# EasyEDA schematic Polarization Contol.json

## Sheets
1 Sheet_1: TITLE: Sheet_1; REV: 1.0; Date: 2023-02-22; Sheet: 1/1; Company: Your Company
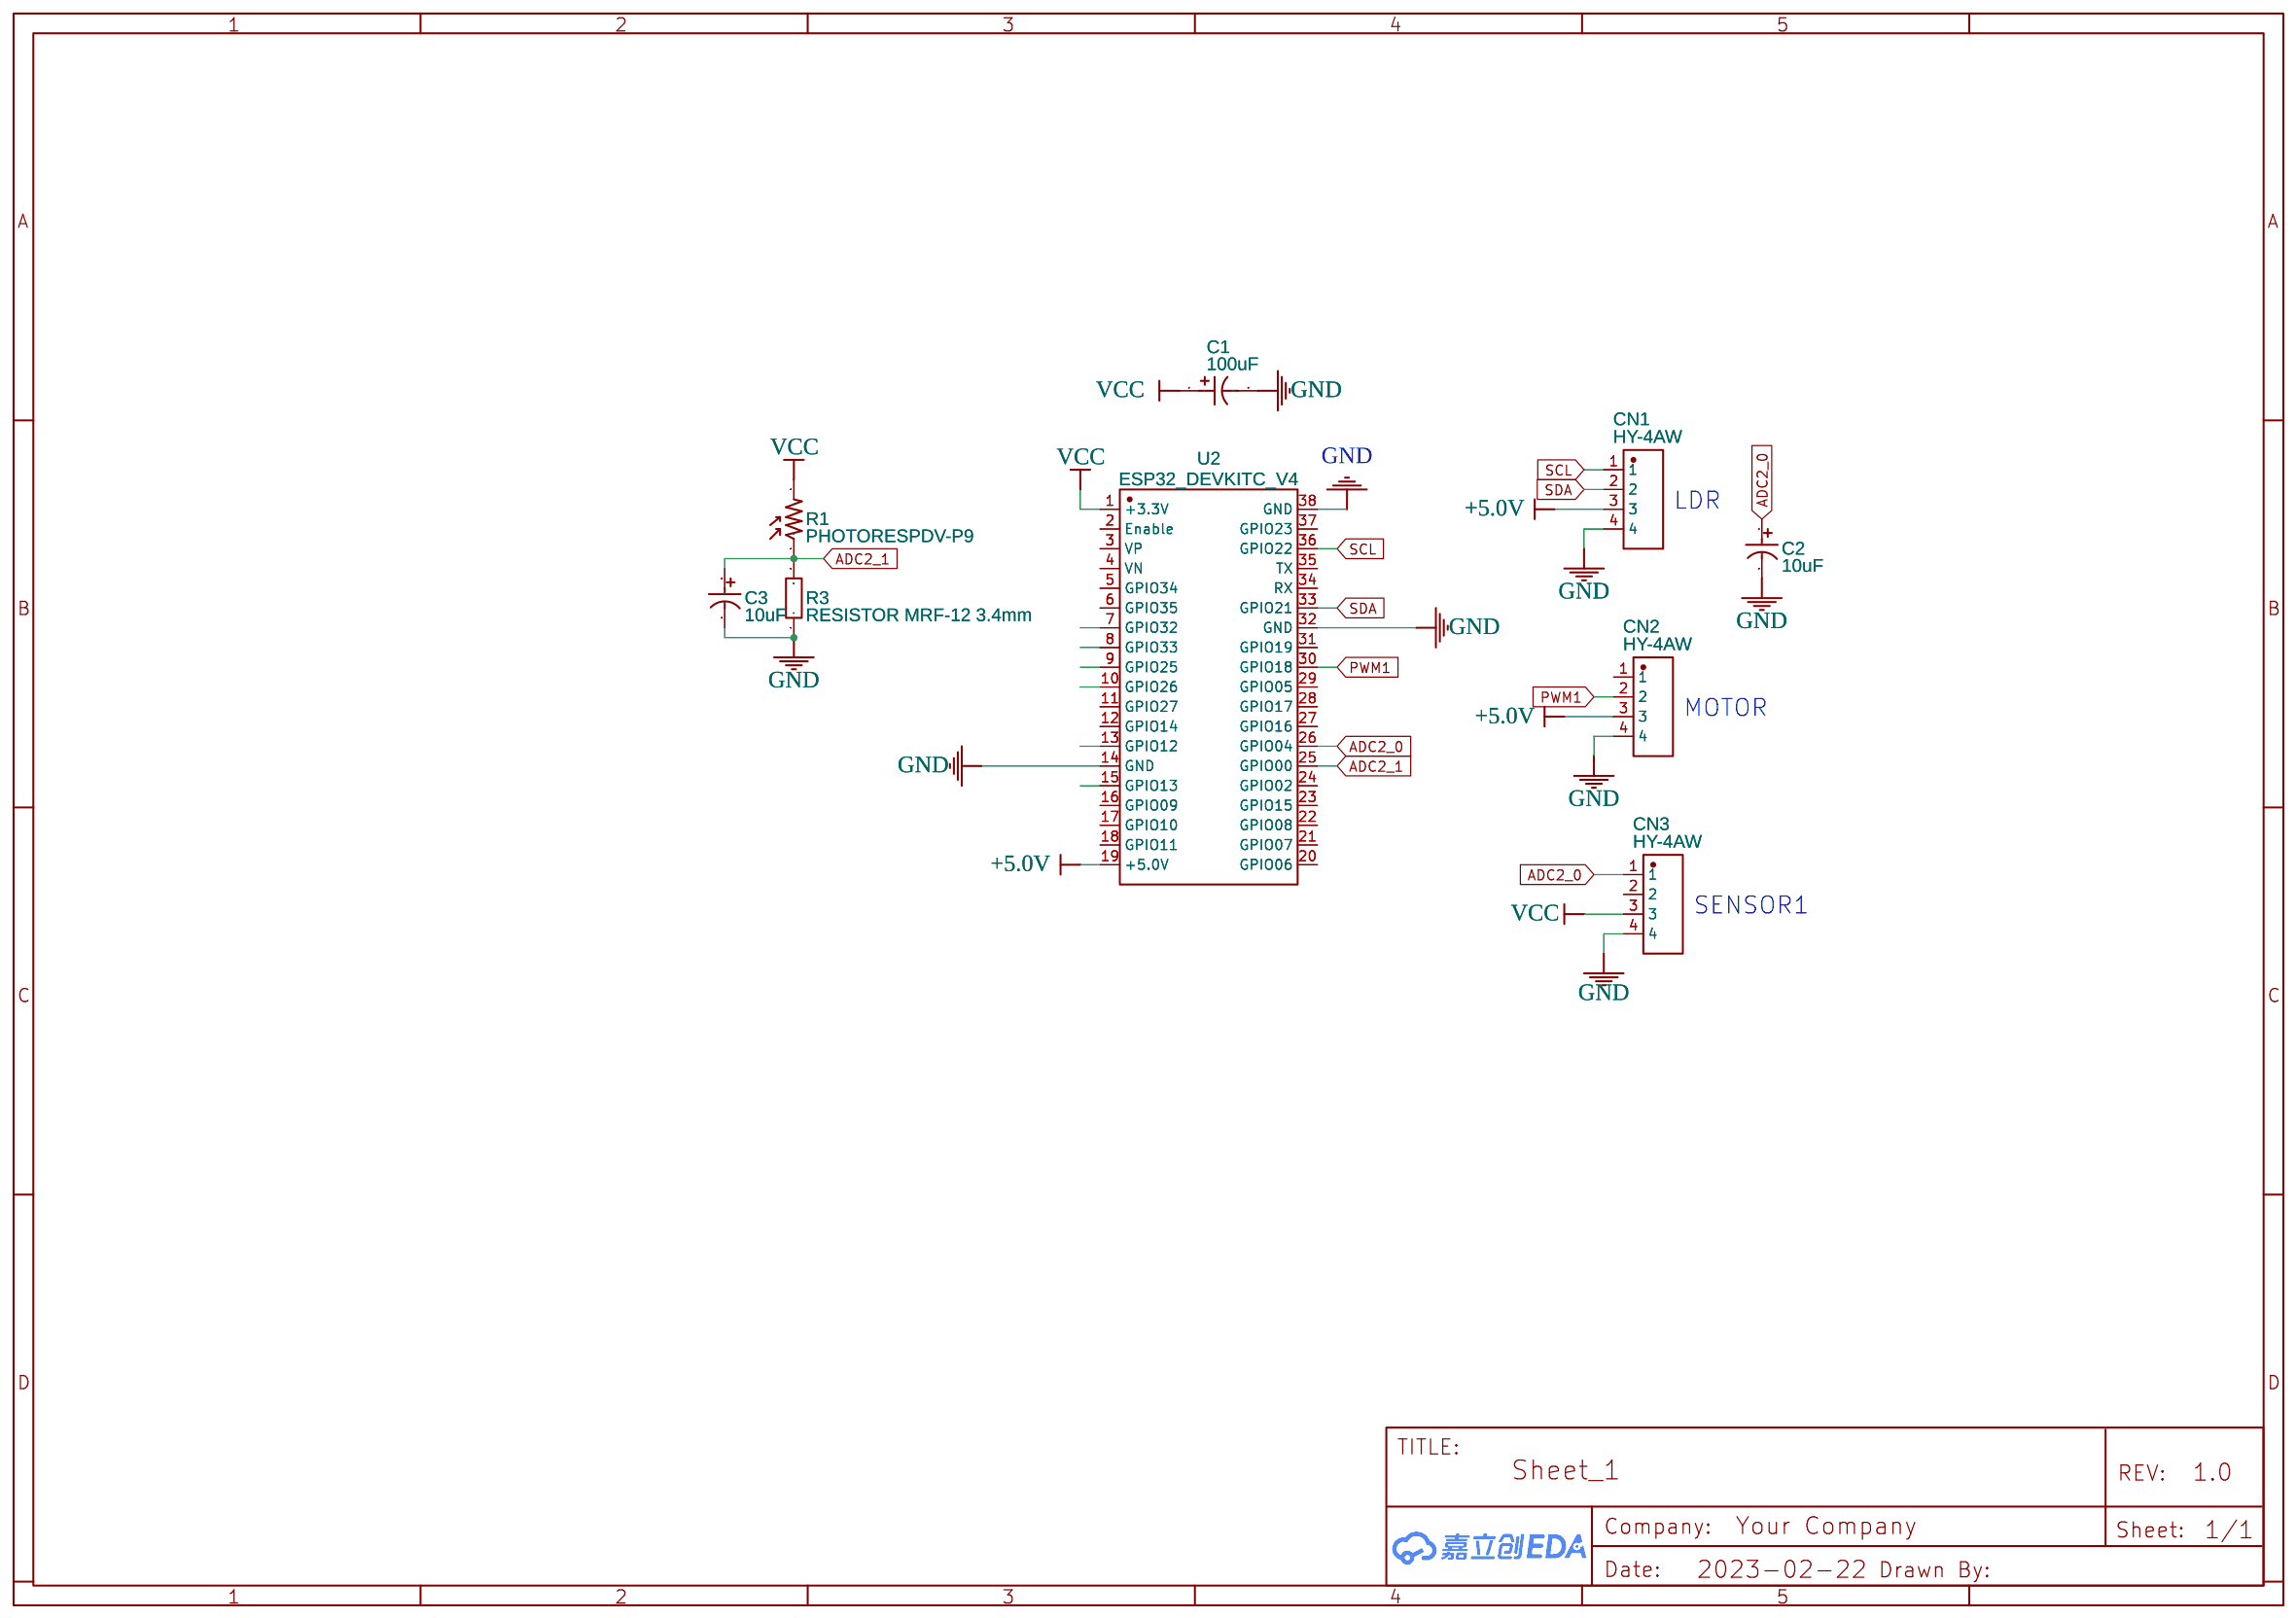
[diagram p0: Sheet_1]
2 Sheet_2: TITLE: Sheet_2
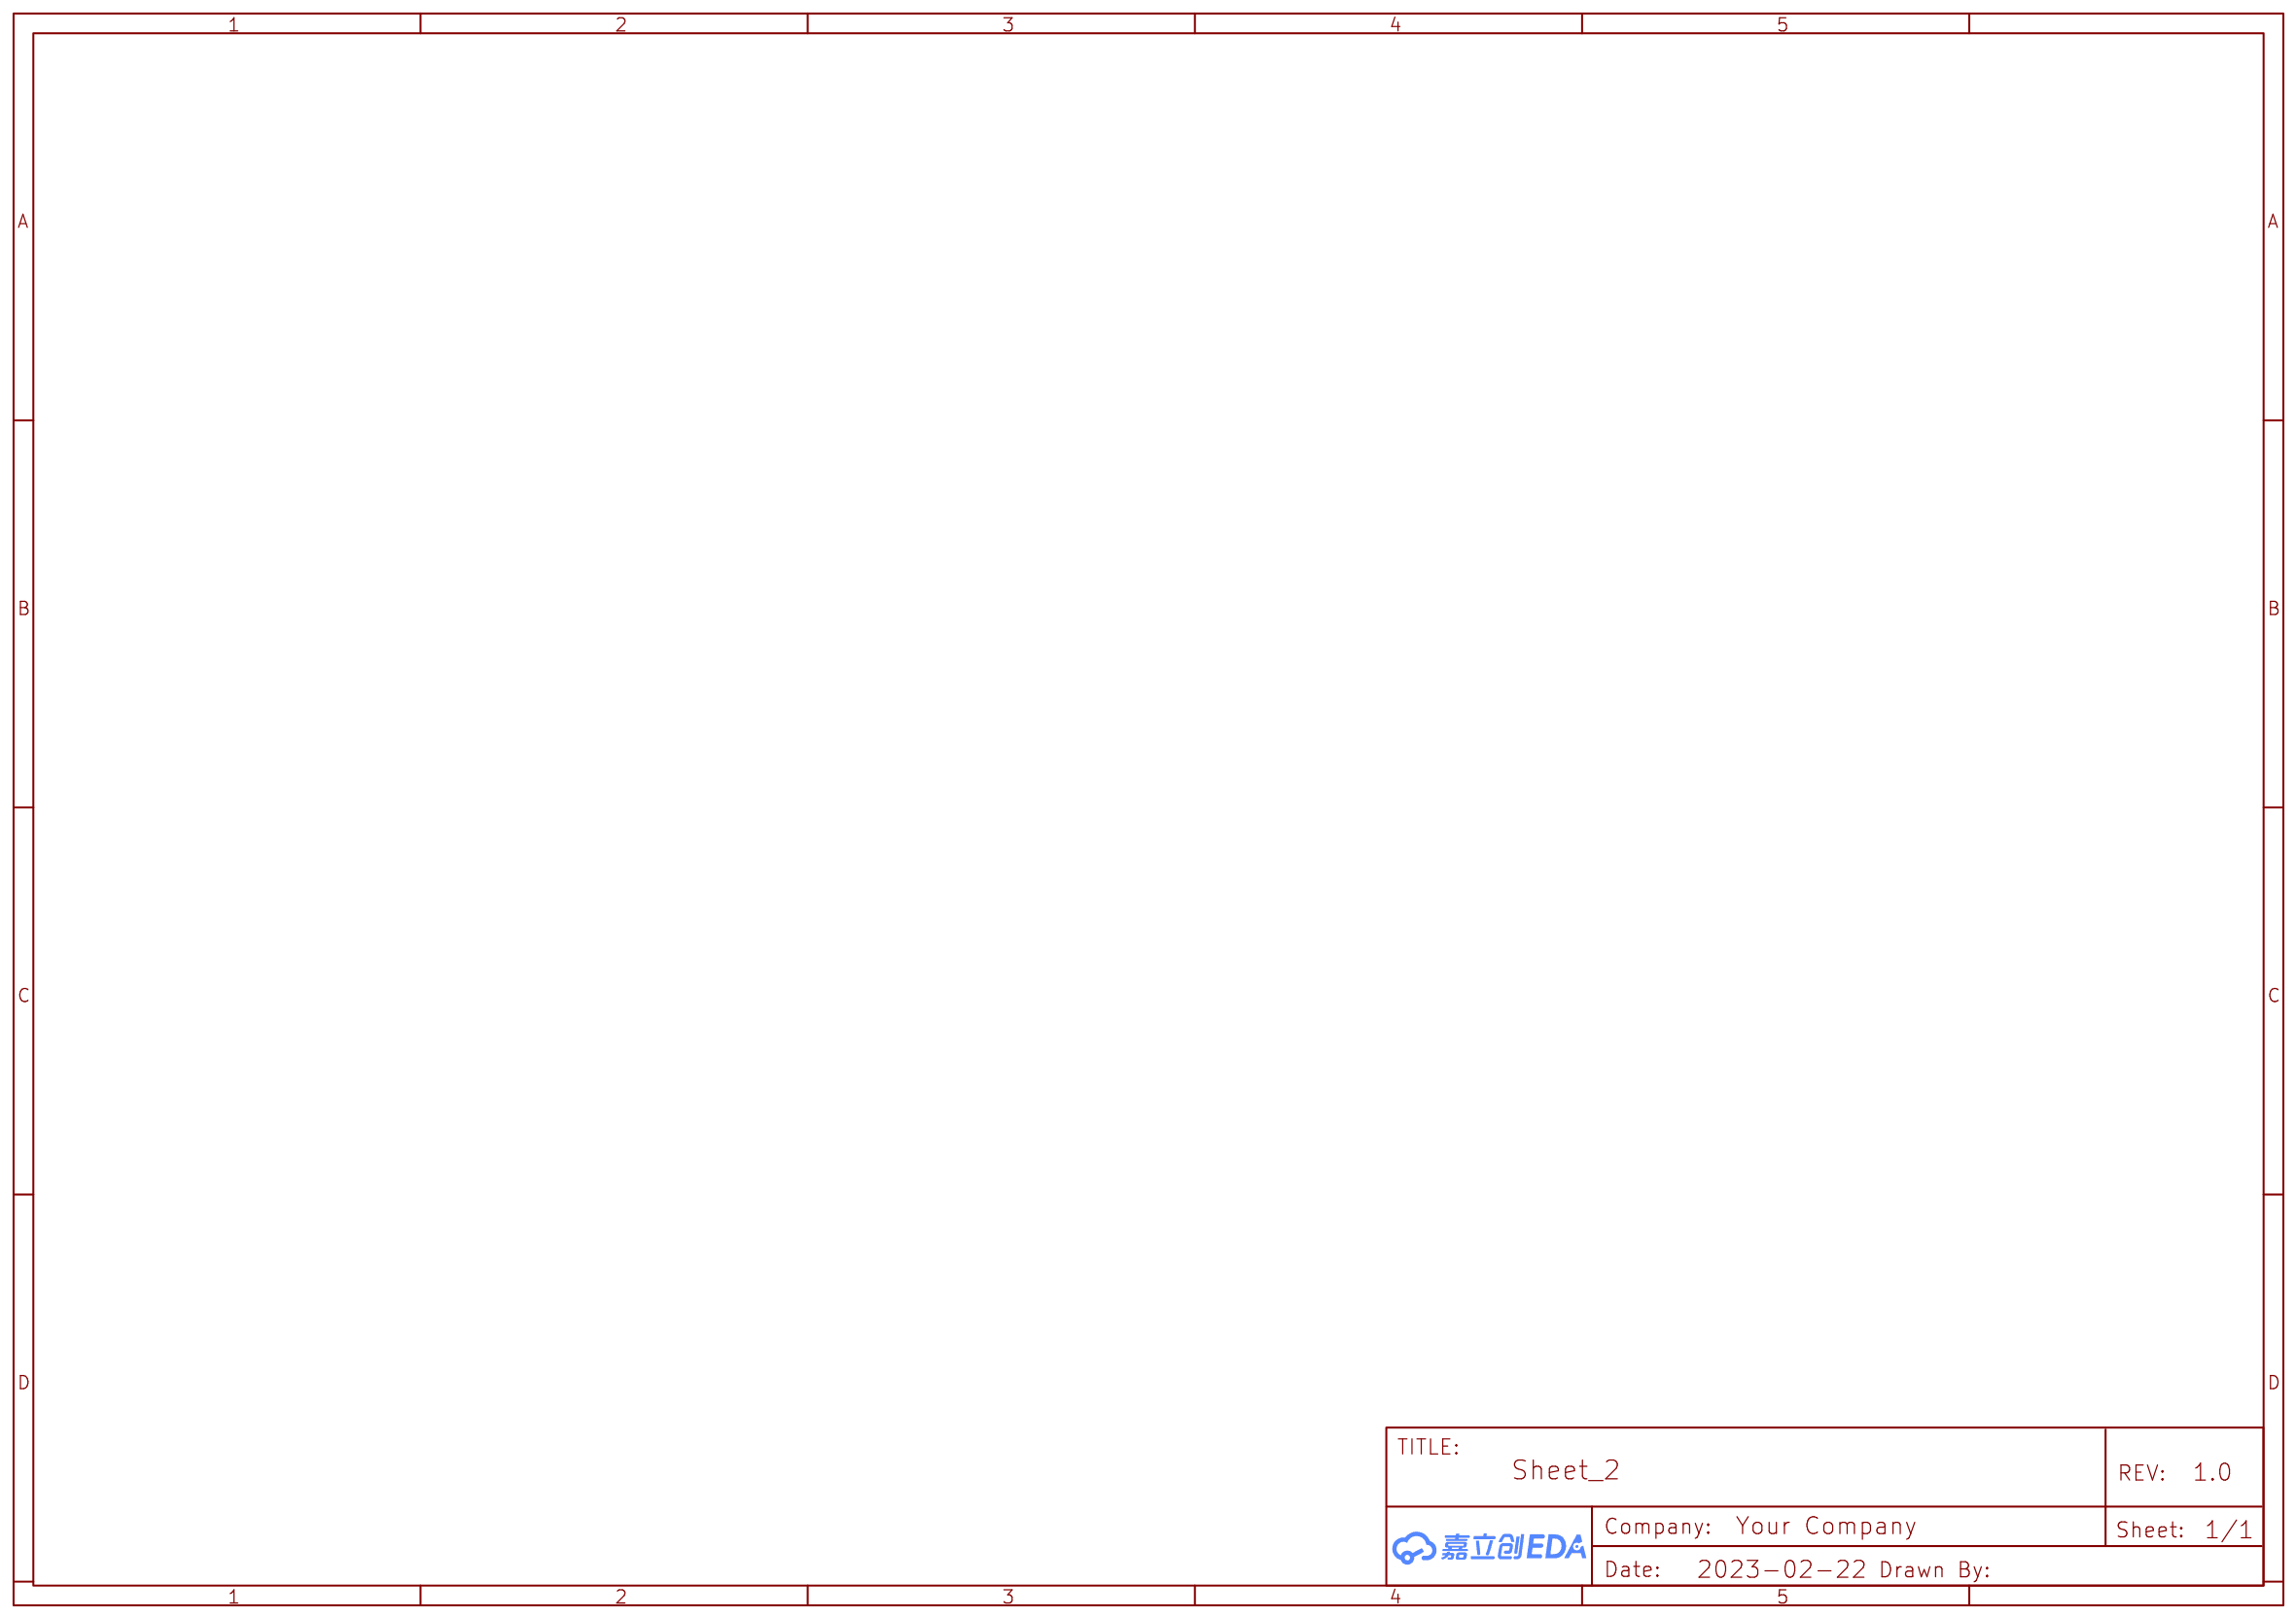
[diagram p1: Sheet_2]

## Parts
C1  100uF  [CAP-TH_BD6.3-P2.50-D0.5-FD]
C2  10uF  [CAP-TH_BD5.0-P2.00-D0.8-FD]
C3  10uF  [CAP-TH_BD5.0-P2.00-D0.8-FD]
CN1  HY-4AW  [CONN-TH_4P-P2.00_HY-4AW]
CN2  HY-4AW  [CONN-TH_4P-P2.00_HY-4AW]
CN3  HY-4AW  [CONN-TH_4P-P2.00_HY-4AW]
R1  PHOTORESPDV-P9  [PDV-P9XXX]
R3  RESISTOR MRF-12 3.4mm  [RESISTOR-MRF-12]
U2  ESP32_DEVKITC_V4  [ESP32-DEVKITC CORE BOARD ESP32]

## Library data of the parts
C1 = 25V100UF CD110: Supplier: LCSC; Supplier Part: C2960218; Manufacturer: HRK(鸿瑞凯电子); Manufacturer Part: 25V100uF CD110; JLCPCB Part Class: Extended Part; Contributor: lcsc
C2 C3 = 47uF 16V Aluminum electrolytic capacitors: Supplier: LCSC; Manufacturer: CX(承兴); Manufacturer Part: KM476M016D11RR0VH2FP0; Supplier Part: C22320; JLCPCB Part Class: Extended Part
CN1-CN3 = HY-4AW: Supplier: LCSC; Manufacturer: BOOMELE; Contributor: LCSC; Supplier Part: C146068; JLCPCB Part Class: Extended Part
R1 = PHOTORESPDV-P9
R3 = RESISTOR MRF-12 3.4mm: Contributor: neelvio
U2 = ESP32_DEVKITC_V4: Supplier Part: A5130; link: https://www.allnewstep.com/product/5253/%E0%B8%9A%E0%B8%AD%E0%B8%A3%E0%B9%8C%E0%B8%94-esp32-devkitc-core-board-esp32-v4-development-board-esp32-wroom-32u; Contributor: petch.elec14

## Nets
+5.0V: CN1.3 CN2.3 U2.19(+5.0V)
GND: C1.2 C2.2 C3.2 CN1.4 CN2.4 CN3.4 R3.1 U2.14(GND) U2.32(GND) U2.38(GND)
VCC: C1.1 CN3.3 R1.2 U2.1(+3.3V)
ADC2_0: C2.1 CN3.1 U2.26(GPIO04)
ADC2_1: C3.1 R1.1 R3.2 U2.25(GPIO00)
PWM1: CN2.2 U2.30(GPIO18)
SCL: CN1.1 U2.36(GPIO22)
SDA: CN1.2 U2.33(GPIO21)

Not connected (* = marked no-connect by the designer): CN2 1; CN3 2; U2 2(Enable) 3(VP) 4(VN) 5(GPIO34) 6(GPIO35) 7(GPIO32) 8(GPIO33) 9(GPIO25) 10(GPIO26) 11(GPIO27) 12(GPIO14) 13(GPIO12) 15(GPIO13) 16(GPIO09) 17(GPIO10) 18(GPIO11) 20(GPIO06) 21(GPIO07) 22(GPIO08) 23(GPIO15) 24(GPIO02) 27(GPIO16) 28(GPIO17) 29(GPIO05) 31(GPIO19) 34(RX) 35(TX) 37(GPIO23)

## Notes on the sheets
sheet 1
- LDR
- MOTOR
- SENSOR1
